# Altium project 单片机USB下载线_直插mega8.PRJPCB
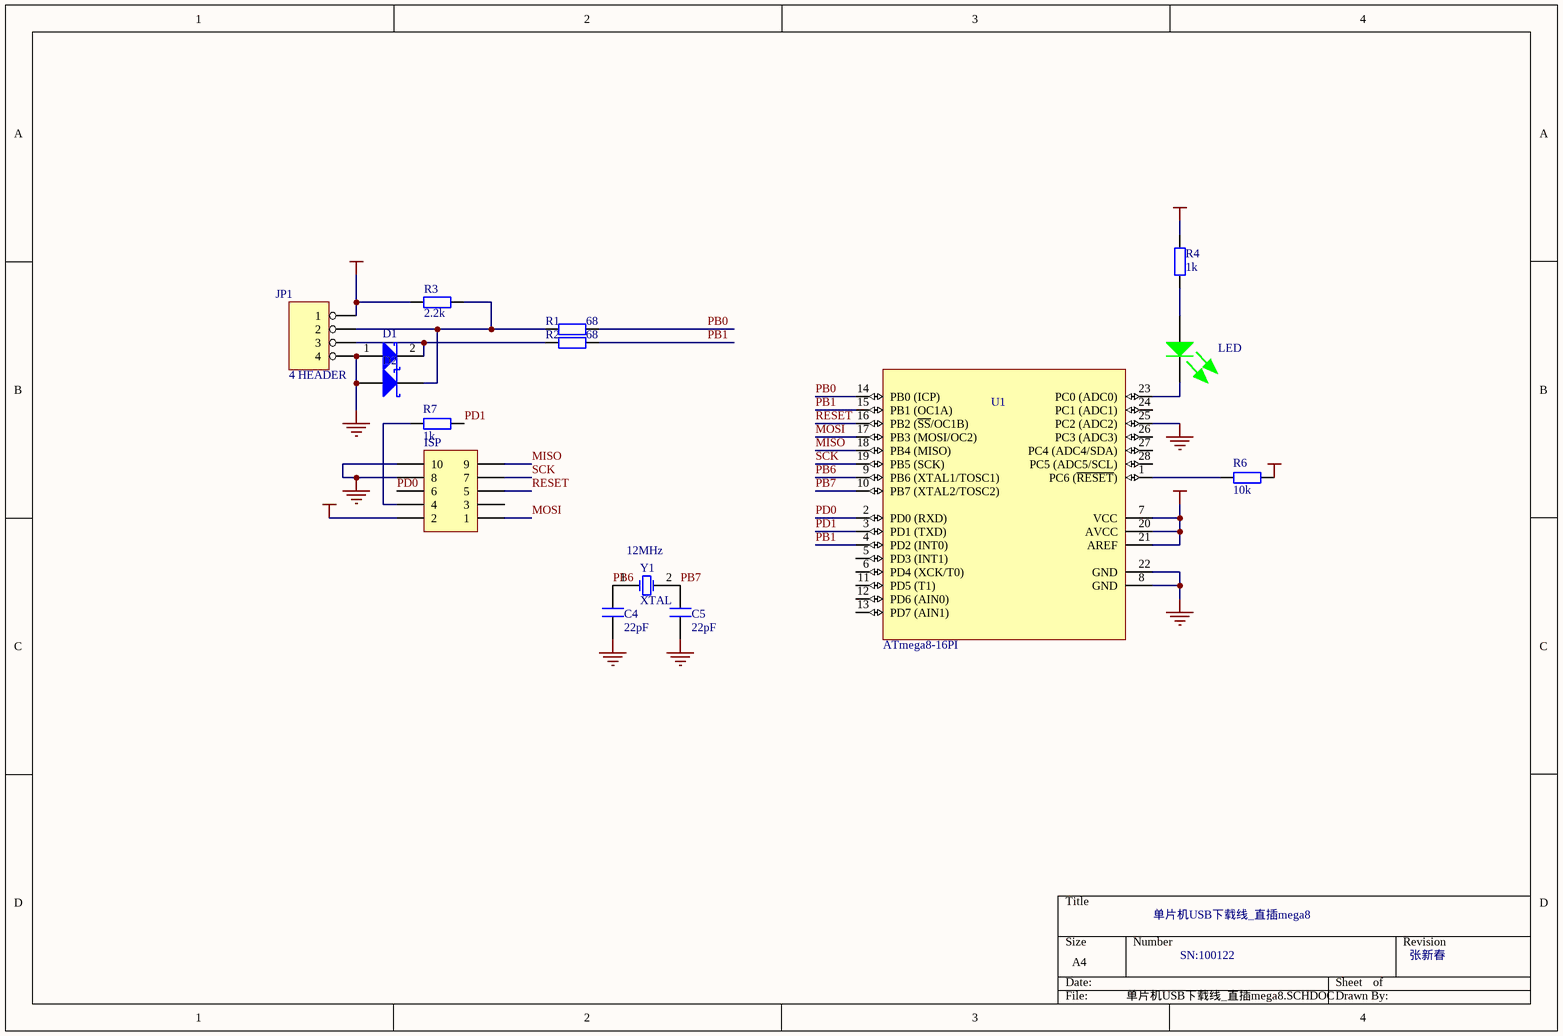
[diagram p0: 单片机USB下载线_直插mega8.SCHDOC]
1 sheet, 15 parts. Net scope: global (net labels, ports and power ports of the same name join across sheets).
Board file: 单片机USB下载线_直插mega8.PCBDOC

## Sheet 单片机USB下载线_直插mega8.SCHDOC
size A4

### Parts
C4  value 22pF  [TP-0805-R]
C5  value 22pF  [TP-0805-R]
D1  Diode 11DQ03  [TPDR]  (value not drawn)
D2  Diode 11DQ03  [TPDR]  (value not drawn)
ISP  (no value)  [HDR2X5]
JP1  4 HEADER  [USB-5V]
LED  (no value)  [TP-0805-D]
R1  value 68  [TP-0805-R]
R2  value 68  [TP-0805-R]
R3  value 2.2k  [TP-0805-R]
R4  value 1k  [TP-0805-R]
R6  value 10k  [TP-0805-R]
R7  value 1k  [TP-0805-R]
U1  ATmega8-16PI  [28P3]
Y1  XTAL  value 12MHz  [JZ_ZC]

### Nets
GND: C4.1 C5.1 D1.1(A) D2.1(A) ISP.8 ISP.10 JP1.4 U1.8(GND) U1.22(GND) U1.25(PC2_(ADC2))
VCC: ISP.2 JP1.1 R3.2 R4.2 R6.2 U1.7(VCC) U1.20(AVCC) U1.21(AREF)
MISO: ISP.9 U1.18(PB4_(MISO))
MOSI: ISP.1 U1.17(PB3_(MOSI/OC2))
PB0: R1.2 U1.14(PB0_(ICP))
PB1: R2.1 U1.4(PD2_(INT0)) U1.15(PB1_(OC1A))
PB6: C4.2 U1.9(PB6_(XTAL1/TOSC1)) Y1.1(OSC1)
PB7: C5.2 U1.10(PB7_(XTAL2/TOSC2)) Y1.2(OSC2)
PD0: ISP.6 U1.2(PD0_(RXD))
PD1: R7.2 U1.3(PD1_(TXD))
RESET: ISP.5 U1.16(PB2_(~{SS}/OC1B))
SCK: ISP.7 U1.19(PB5_(SCK))
NetD1_2: D1.2(K) JP1.3 R2.2
NetD2_2: D2.2(K) JP1.2 R1.1 R3.1
NetISP_4: ISP.4 R7.1
NetLED_1: LED.1 R4.1
NetLED_2: LED.2 U1.23(PC0_(ADC0))
NetR6_1: R6.1 U1.1(PC6_(~{RESET}))

Not connected (* = marked no-connect by the designer): ISP 3; U1 5(PD3_(INT1)) 6(PD4_(XCK/T0)) 11(PD5_(T1)) 12(PD6_(AIN0)) 13(PD7_(AIN1)) 24(PC1_(ADC1)) 26(PC3_(ADC3)) 27(PC4_(ADC4/SDA)) 28(PC5_(ADC5/SCL))

### Notes on the sheet
- 单片机USB下载线_直插mega8
- SN:100122
- 张新春

### Library data of the parts
C4 C5 = CAPSMD: Capacitor SMD1206; Bolt: RET; Kód: 93-00-19
D1 D2 = Diode 11DQ03: Schottky Rectifier; Published: 8-Jun-2000; LatestRevisionDate: 17-Jul-2002; LatestRevisionNote: Re-released for DXP Platform.; DatasheetDocument: Dec-1997; PackageReference: DO-204AL; Publisher: Altium Limited; Code_JEDEC: DO-204-AL
ISP = MLW10A: Header, 5-Pin, Dual row, Right Angle; Manufacturer: Generic Components; Class: Connector; Bolt: RET; Kód: 53-02-64
JP1 = 4 HEADER: 4 Pin Header
LED = LED Zöld: Zöld Led 3mm; Bolt: RET; Kód: 46-01-42; Value: Zöld
R1-R4 R6 R7 = RES: Resistor SMD1206, 1% fémréteg; Bolt: RET; Kód: 96-00-73
U1 = ATmega8-16PI: 8-Bit AVR Microcontroller with 8K Bytes of In-System Programmable Flash Memory; PackageDocument: revB, Sep-2001; Published: 17-Sep-2003; LatestRevisionDate: 4-Mar-2005; LatestRevisionNote: Stylized 3D Model Added.; DatasheetDocument: 2486H-AVR-09/02; PackageReference: 28P3; Publisher: Altium Limited; ComponentLink1Description: Manufacturer Link; ComponentLink1URL: http://www.atmel.com; ComponentLink2Description: Datasheet; ComponentLink2URL: http://www.atmel.com/dyn/resources/prod_documents/doc2486.pdf
Y1 = XTAL: Crystal Oscillator; Manufacturer: Generic Components; Bolt: RET; Published: 08/06/2000; Publisher: Altium Hobart Technology Centre; Class: Oscillator; SubClass: Crystal Oscillator; Kód: 62-00-45